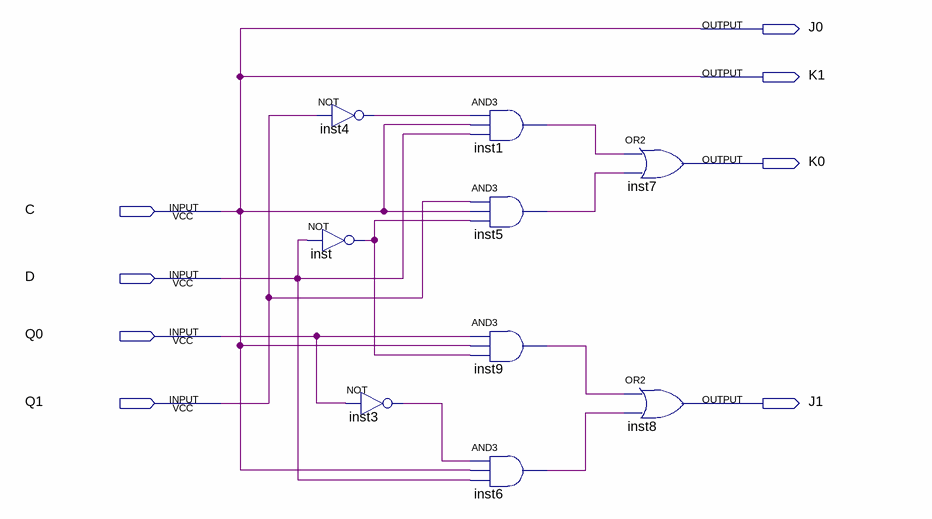
[diagram p0: schematic sheet]
// Quartus schematic NEXT_STATE.bdf as structural Verilog: 9 symbols, 8 pins
module NEXT_STATE (
  input  C,
  input  D,
  input  Q0,
  input  Q1,
  output J0,
  output K1,
  output K0,
  output J1
);

  wire inst1_out, inst3_out, inst4_out, inst5_out, inst6_out, inst9_out, inst_out;

  not inst4 (inst4_out, Q1);
  not inst (inst_out, D);
  not inst3 (inst3_out, Q0);
  and inst1 (inst1_out, inst4_out, C, D);
  and inst5 (inst5_out, Q1, C, inst_out);
  and inst9 (inst9_out, Q0, C, inst_out);
  and inst6 (inst6_out, inst3_out, C, D);
  or inst7 (K0, inst1_out, inst5_out);
  or inst8 (J1, inst9_out, inst6_out);

  assign J0 = C;
  assign K1 = C;
endmodule
